# EAGLE schematic hl_bme280_out_pcb (EAGLE 9.1.3)
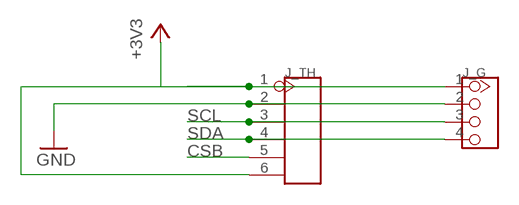
[diagram p0: schematic, sheet 1]

## Parts
J_G  TWIG-4P-2.0-2.0  [4P-2.0]
J_TH  HEADER-6P-80/40MIL  [6P-2.54-80/40MIL]

## Nets
+3V3: J_G.1 J_TH.1 J_TH.6
CSB: J_TH.5
GND [power_5V]: J_G.2 J_TH.2
SCL: J_G.3 J_TH.3
SDA: J_G.4 J_TH.4

## Library data of the parts
J_G = Connector:TWIG-4P-2.0
J_TH = Connector:HEADER-6P

## Net classes
0 default: width 0.4 mm, clearance 0.7 mm
1 power_5V: width 1 mm, clearance 0.7 mm